# EasyEDA Pro project STM32F407VG.eprj

# Schematic Schematic1
Board Name: Board1; Create Date: 2025-10-14; Page Name: P1; Project Name: STM32F407VG; Schematic Name: Schematic1; Update Date: 2025-10-16; Company: 嘉立创EDA; Page Size: A4; Version: V1.0
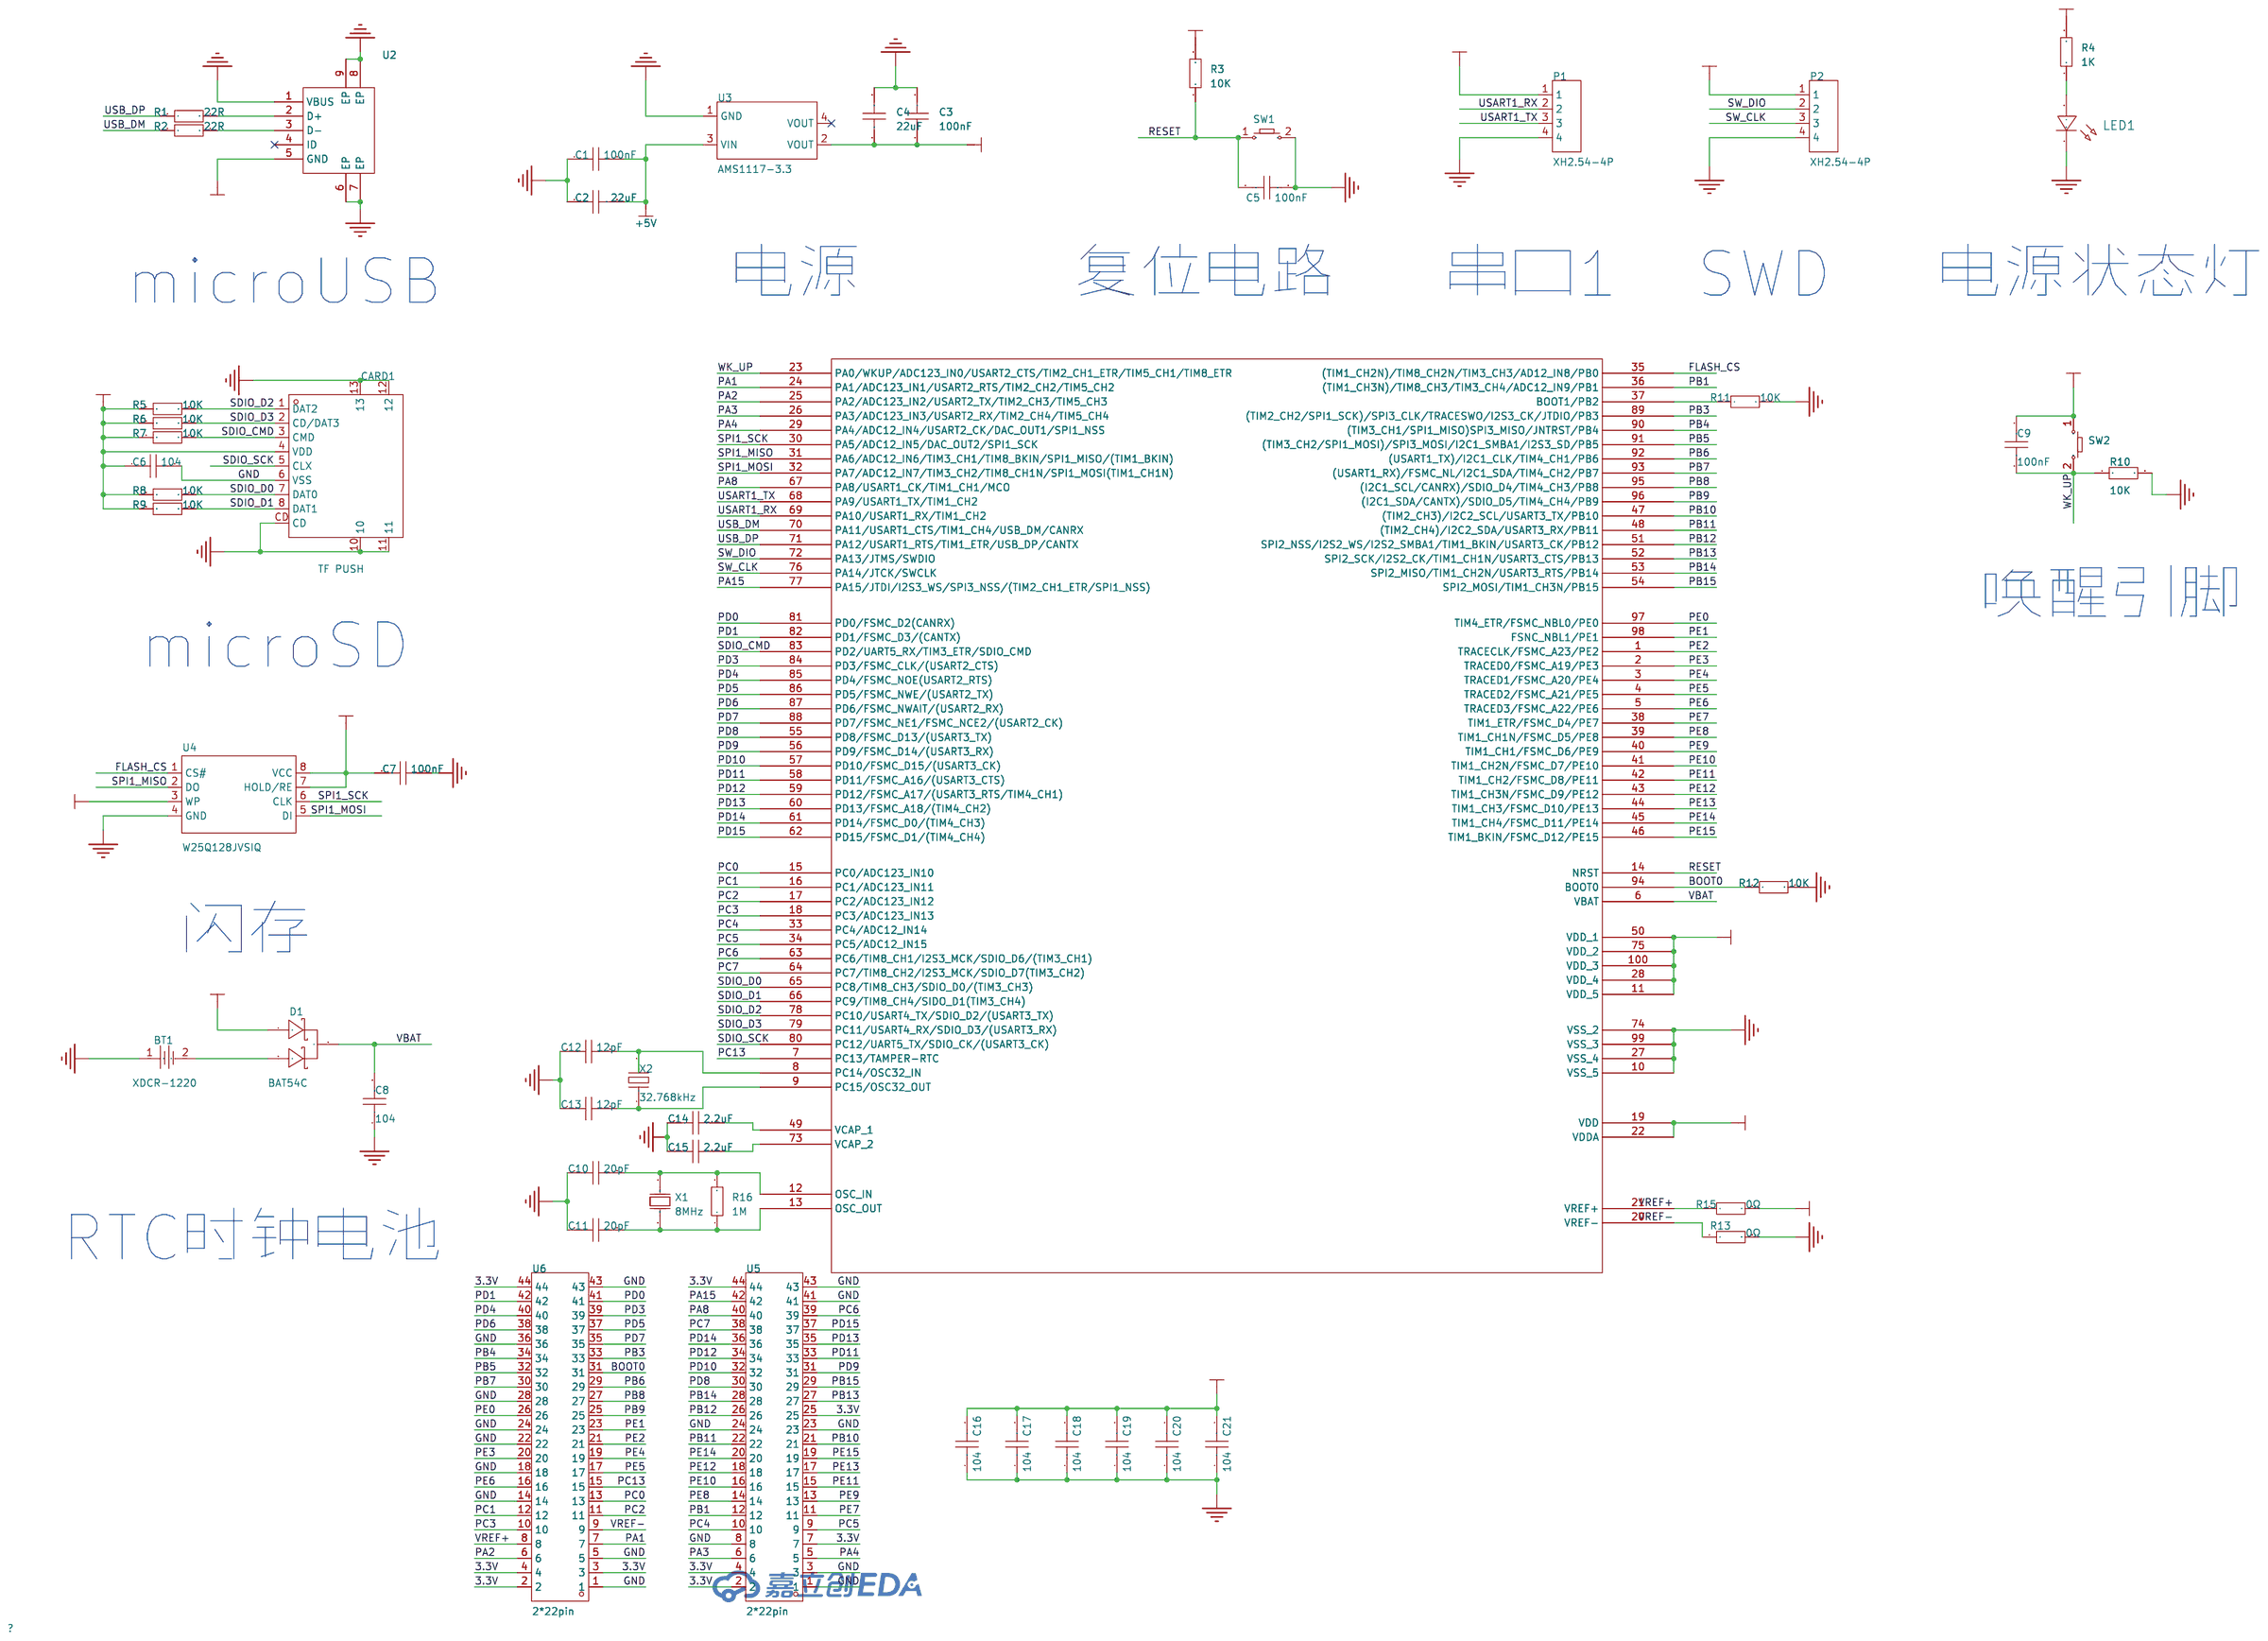
[diagram p0: schematic sheet]

## Parts
BT1  XDCR-1220  [BAT-SMD_CR1220-2ZX]
C1  100nF  [C0603]
C2  22uF  [C0603]
C3  100nF  [C0603]
C4  22uF  [C0603]
C5  100nF  [C0603]
C6  104  [C0603]
C7  100nF  [C0603]
C8  104  [C0603]
C9  100nF  [C0603]
C10  20pF  [C0603]
C11  20pF  [C0603]
C12  12pF  [C0603]
C13  12pF  [C0603]
C14  2.2uF  [C0603]
C15  2.2uF  [C0603]
C16  104  [C0603]
C17  104  [C0603]
C18  104  [C0603]
C19  104  [C0603]
C20  104  [C0603]
C21  104  [C0603]
CARD1  TF PUSH  [TF-SMD_TF-PUSH]
D1  BAT54C  [SOT-23-3_L2.9-W1.6-P1.90-LS2.8-BR]
LED1  -  [LED_0603]
P1  XH2.54-4P  [CONN-TH_4P-P2.50-XH2.54-4P]
P2  XH2.54-4P  [CONN-TH_4P-P2.50-XH2.54-4P]
R1  22R  [R0603]
R2  22R  [R0603]
R3  10K  [R0603]
R4  1K  [R0603]
R5  10K  [R0603]
R6  10K  [R0603]
R7  10K  [R0603]
R8  10K  [R0603]
R9  10K  [R0603]
R10  10K  [R0603]
R11  10K  [R-BIG-0603]
R12  10K  [R-BIG-0603]
R13  0Ω  [R-BIG-0603]
R15  0Ω  [R-BIG-0603]
R16  1M  [R0603]
SW1  -  [Key_SMD_3x4x2]
SW2  -  [Key_SMD_3x4x2]
U1  STM32F407VGT6  [STM32F407VG]
U2  USB-Micro-5P  [MICRO-USB-SMD_MICRO-USB-A9]
U3  AMS1117-3.3  [SOT-223-3_L6.5-W3.4-P2.30-LS7.0-BR]
U4  W25Q128JVSIQ  [SOIC-8_L5.3-W5.3-P1.27-LS8.0-BL]
U5  2*22pin  [HDR-TH_44P-2.54-V-F-R2-C22-S2.54]
U6  2*22pin  [HDR-TH_44P-2.54-V-F-R2-C22-S2.54]
X1  8MHz  [OSC-TH_L10.0-W4.5-P5.00]
X2  32.768kHz  [OSC-SMD_L3.2-W1.5]

## Library data of the parts
BT1 = XDCR-1220-006: LCSC Part Name: 电池底座 适用电池:CR1220; Supplier Part: C7498147; Manufacturer: LX(连欣科技); Supplier Footprint: SMD; JLCPCB Part Class: 扩展库; Datasheet: https://item.szlcsc.com/datasheet/XDCR-1220-006/8568589.html; Supplier: LCSC; Connector Type: 电池底座; Battery Type: CR1220; Contact Plating: 金; Operating Temperature: -40℃~+85℃
C1-C21 = CAP_0603: Supplier Footprint: 0603
CARD1 = TF PUSH: LCSC Part Name: 自弹式 MicroSD卡(TF卡) 卡座; Supplier Part: C393941; Manufacturer: SHOU HAN(首韩); Supplier Footprint: SMD; JLCPCB Part Class: 扩展库; Datasheet: https://item.szlcsc.com/datasheet/TF%2520PUSH/372553.html; Supplier: LCSC; Card Connection Mode: 自弹式; Card Type: MicroSD卡(TF卡); Connector Type: 卡座; Additional Card Detection Pins: 无; Height Above Board: 2mm; Operating Temperature: -25℃~+90℃
D1 = BAT54C,215: LCSC Part Name: 电压:30V 电流:200mA; Supplier Part: C37704; Manufacturer: Nexperia(安世); Supplier Footprint: SOT-23; JLCPCB Part Class: 扩展库; Datasheet: https://item.szlcsc.com/datasheet/BAT54C%252C215/38684.html; Supplier: LCSC; Diode Configuration: 1对共阴极; Voltage - Forward(Vf@If): 800mV@100mA; Voltage - DC Reverse(Vr): 30V; Current - Rectified: 200mA; Reverse Leakage Current (Ir): 2uA@25V; Non-Repetitive Peak Forward Surge Current: 600mA
LED1 = LED_0603-R: Supplier Footprint: 0603
P1 P2 = XH2.54-4P_C9900003326: Supplier Part: C9900003326; JLCPCB Part Class: 扩展库; Supplier: LCSC
R1-R13 R15 R16 = Res_0603: Supplier Footprint: 0603
SW1 SW2 = Key_SMD_3x4x2: Supplier Footprint: SMD
U1 = STM32F407VGT6
U2 = USB-Micro-5P: Supplier Part: C9900014288; JLCPCB Part Class: 扩展库; Supplier: LCSC
U3 = AMS1117-3.3_C6186: 输出类型:固定;工作电压:16V;输出电压:3.3V;输出电流:1A;电源纹波抑制比(PSRR):72dB@(120Hz);输出极性:正极;; LCSC Part Name: 输出3.3V 1A; Supplier Part: C6186; Manufacturer: AMS; Supplier Footprint: SOT-223; JLCPCB Part Class: 基础库; Datasheet: https://item.szlcsc.com/datasheet/AMS1117-3.3/6652.html; Supplier: LCSC; Output Type: 固定; Voltage - Supply: 16V; Output Voltage: 3.3V; Output Current: 1A; Power Supply Rejection Ratio (PSRR): 72dB@(120Hz); Voltage Dropout: 1.1V@(800mA); standby current: 5mA; Features: 过流保护；过热保护; Operating Temperature: -40℃~+125℃; Output Configuration: 正极; Number of Outputs: 1
U4 = W25Q128JVSIQ: 接口类型:SPI;存储容量:128Mbit;时钟频率(fc):133MHz;; LCSC Part Name: 编带 支持双路/四路SPI接口的3V、128Mbit 串行闪存; Supplier Part: C97521; Manufacturer: Winbond(华邦); Supplier Footprint: SOIC-8-208mil; JLCPCB Part Class: 基础库; Datasheet: https://item.szlcsc.com/datasheet/W25Q128JVSIQ/98729.html; Supplier: LCSC; Interface: SPI; Memory Size: 128Mbit; Clock Frequency: 133MHz; Voltage - Supply: 2.7V~3.6V; Standby Supply Current: 1uA; Program / Erase Cycles: 100000次; Page Programming Time (Tpp): 3ms; Block Erase Time(tBE): 120ms@(32KB); Data Retention - TDR (Year): 20年; Operating Temperature: -40℃~+85℃
U5 U6 = CS-1166SDIG-2X22(H8.5): LCSC Part Name: 2x22P 间距:2.54mm 直插; Supplier Part: C2986996; Manufacturer: CST(永丰盈); Supplier Footprint: 插件,P=2.54mm; JLCPCB Part Class: 扩展库; Datasheet: https://item.szlcsc.com/datasheet/CS-1166SDIG-2X22(H8.5)/3437779.html; Supplier: LCSC; Holes Structure: 2x22P; Pitch: 2.54mm; Row Spacing: 2.54mm; Mounting Type: 直插; Number of Rows: 双排; Number of Positions: 44P; Holes Direction: 顶部; Insulation Height: 8.5mm
X1 = X49SD8MSD2SC: LCSC Part Name: HC-49US 8MHZ 2P 49S 20PF ±20PPM -20~70℃ (±30PPM); Supplier Part: C21263; Manufacturer: YXC(扬兴晶振); Supplier Footprint: HC-49S; JLCPCB Part Class: 扩展库; Datasheet: https://item.szlcsc.com/datasheet/X49SD8MSD2SC/21980.html; Supplier: LCSC; Type: 直插晶振; Normal temperature Frequency Tolerance: ±20ppm; Load Capacitance: 20pF; Frequency Stability: ±30ppm; Operating Temperature: -20℃~+70℃
X2 = X321532768KGD2SI: LCSC Part Name: YST310S 32.768KHZ 2P 3215 12.5PF ±20PPM -40~85℃; Supplier Part: C620155; Manufacturer: YXC(扬兴晶振); Supplier Footprint: SMD3215-2P; JLCPCB Part Class: 扩展库; Datasheet: https://item.szlcsc.com/datasheet/X321532768KGD2SI/649983.html; Supplier: LCSC; Type: 贴片晶振; Normal temperature Frequency Tolerance: ±20ppm; Load Capacitance: 12.5pF; Frequency Stability: ±30ppm; Operating Temperature: -40℃~+85℃

## Nets
3.3V: C3.2 C4.2 C6.1 C7.1 C9.2 C16.2 C17.2 C18.2 C19.2 C20.2 C21.2 CARD1.4(VDD) D1.1(A) P1.1 P2.1 R3.1 R4.2 R5.1 R6.1 R7.1 R8.1 R9.1 R15.2 SW2.1 U1.11(VDD_5) U1.19(VDD) U1.22(VDDA) U1.28(VDD_4) U1.50(VDD_1) U1.75(VDD_2) U1.100(VDD_3) U3.2(VOUT) U4.3(WP) U4.7(HOLD/RE) U4.8(VCC) U5.2 U5.4 U5.7 U5.25 U5.44 U6.2 U6.3 U6.4 U6.44
+5V: C1.2 C2.2 U2.5(GND) U3.3(VIN)
GND: BT1.1 C1.1 C2.1 C3.1 C4.1 C5.2 C6.2 C7.2 C8.1 C10.1 C11.1 C12.1 C13.1 C14.1 C15.1 C16.1 C17.1 C18.1 C19.1 C20.1 C21.1 CARD1.6(VSS) CARD1.10 CARD1.11 CARD1.12 CARD1.13 CARD1.CD LED1.1(C) P1.4 P2.4 R10.2 R11.2 R12.2 R13.2 SW1.2 U1.10(VSS_5) U1.27(VSS_4) U1.74(VSS_2) U1.99(VSS_3) U2.1(VBUS) U2.6(EP) U2.7(EP) U2.8(EP) U2.9(EP) U3.1(GND) U4.4(GND) U5.1 U5.3 U5.8 U5.23 U5.24 U5.41 U5.43 U6.1 U6.5 U6.14 U6.18 U6.22 U6.24 U6.28 U6.36 U6.43
VBAT: C8.2 D1.3(K) U1.6(VBAT)
BOOT0: R12.1 U1.94(BOOT0) U6.31
FLASH_CS: U1.35((TIM1_CH2N)/TIM8_CH2N/TIM3_CH3/AD12_IN8/PB0) U4.1(CS#)
PA1: U1.24(PA1/ADC123_IN1/USART2_RTS/TIM2_CH2/TIM5_CH2) U6.7
PA2: U1.25(PA2/ADC123_IN2/USART2_TX/TIM2_CH3/TIM5_CH3) U6.6
PA3: U1.26(PA3/ADC123_IN3/USART2_RX/TIM2_CH4/TIM5_CH4) U5.6
PA4: U1.29(PA4/ADC12_IN4/USART2_CK/DAC_OUT1/SPI1_NSS) U5.5
PA8: U1.67(PA8/USART1_CK/TIM1_CH1/MCO) U5.40
PA15: U1.77(PA15/JTDI/I2S3_WS/SPI3_NSS/(TIM2_CH1_ETR/SPI1_NSS)) U5.42
PB1: U1.36((TIM1_CH3N)/TIM8_CH3/TIM3_CH4/ADC12_IN9/PB1) U5.12
PB3: U1.89((TIM2_CH2/SPI1_SCK)/SPI3_CLK/TRACESWO/I2S3_CK/JTDIO/PB3) U6.33
PB4: U1.90((TIM3_CH1/SPI1_MISO)SPI3_MISO/JNTRST/PB4) U6.34
PB5: U1.91((TIM3_CH2/SPI1_MOSI)/SPI3_MOSI/I2C1_SMBA1/I2S3_SD/PB5) U6.32
PB6: U1.92((USART1_TX)/I2C1_CLK/TIM4_CH1/PB6) U6.29
PB7: U1.93((USART1_RX)/FSMC_NL/I2C1_SDA/TIM4_CH2/PB7) U6.30
PB8: U1.95((I2C1_SCL/CANRX)/SDIO_D4/TIM4_CH3/PB8) U6.27
PB9: U1.96((I2C1_SDA/CANTX)/SDIO_D5/TIM4_CH4/PB9) U6.25
PB10: U1.47((TIM2_CH3)/I2C2_SCL/USART3_TX/PB10) U5.21
PB11: U1.48((TIM2_CH4)/I2C2_SDA/USART3_RX/PB11) U5.22
PB12: U1.51(SPI2_NSS/I2S2_WS/I2S2_SMBA1/TIM1_BKIN/USART3_CK/PB12) U5.26
PB13: U1.52(SPI2_SCK/I2S2_CK/TIM1_CH1N/USART3_CTS/PB13) U5.27
PB14: U1.53(SPI2_MISO/TIM1_CH2N/USART3_RTS/PB14) U5.28
PB15: U1.54(SPI2_MOSI/TIM1_CH3N/PB15) U5.29
PC0: U1.15(PC0/ADC123_IN10) U6.13
PC1: U1.16(PC1/ADC123_IN11) U6.12
PC2: U1.17(PC2/ADC123_IN12) U6.11
PC3: U1.18(PC3/ADC123_IN13) U6.10
PC4: U1.33(PC4/ADC12_IN14) U5.10
PC5: U1.34(PC5/ADC12_IN15) U5.9
PC6: U1.63(PC6/TIM8_CH1/I2S3_MCK/SDIO_D6/(TIM3_CH1)) U5.39
PC7: U1.64(PC7/TIM8_CH2/I2S3_MCK/SDIO_D7(TIM3_CH2)) U5.38
PC13: U1.7(PC13/TAMPER-RTC) U6.15
PD0: U1.81(PD0/FSMC_D2(CANRX)) U6.41
PD1: U1.82(PD1/FSMC_D3/(CANTX)) U6.42
PD3: U1.84(PD3/FSMC_CLK/(USART2_CTS)) U6.39
PD4: U1.85(PD4/FSMC_NOE(USART2_RTS)) U6.40
PD5: U1.86(PD5/FSMC_NWE/(USART2_TX)) U6.37
PD6: U1.87(PD6/FSMC_NWAIT/(USART2_RX)) U6.38
PD7: U1.88(PD7/FSMC_NE1/FSMC_NCE2/(USART2_CK)) U6.35
PD8: U1.55(PD8/FSMC_D13/(USART3_TX)) U5.30
PD9: U1.56(PD9/FSMC_D14/(USART3_RX)) U5.31
PD10: U1.57(PD10/FSMC_D15/(USART3_CK)) U5.32
PD11: U1.58(PD11/FSMC_A16/(USART3_CTS)) U5.33
PD12: U1.59(PD12/FSMC_A17/(USART3_RTS/TIM4_CH1)) U5.34
PD13: U1.60(PD13/FSMC_A18/(TIM4_CH2)) U5.35
PD14: U1.61(PD14/FSMC_D0/(TIM4_CH3)) U5.36
PD15: U1.62(PD15/FSMC_D1/(TIM4_CH4)) U5.37
PE0: U1.97(TIM4_ETR/FSMC_NBL0/PE0) U6.26
PE1: U1.98(FSNC_NBL1/PE1) U6.23
PE2: U1.1(TRACECLK/FSMC_A23/PE2) U6.21
PE3: U1.2(TRACED0/FSMC_A19/PE3) U6.20
PE4: U1.3(TRACED1/FSMC_A20/PE4) U6.19
PE5: U1.4(TRACED2/FSMC_A21/PE5) U6.17
PE6: U1.5(TRACED3/FSMC_A22/PE6) U6.16
PE7: U1.38(TIM1_ETR/FSMC_D4/PE7) U5.11
PE8: U1.39(TIM1_CH1N/FSMC_D5/PE8) U5.14
PE9: U1.40(TIM1_CH1/FSMC_D6/PE9) U5.13
PE10: U1.41(TIM1_CH2N/FSMC_D7/PE10) U5.16
PE11: U1.42(TIM1_CH2/FSMC_D8/PE11) U5.15
PE12: U1.43(TIM1_CH3N/FSMC_D9/PE12) U5.18
PE13: U1.44(TIM1_CH3/FSMC_D10/PE13) U5.17
PE14: U1.45(TIM1_CH4/FSMC_D11/PE14) U5.20
PE15: U1.46(TIM1_BKIN/FSMC_D12/PE15) U5.19
RESET: C5.1 R3.2 SW1.1 U1.14(NRST)
SDIO_CMD: CARD1.3(CMD) R7.2 U1.83(PD2/UART5_RX/TIM3_ETR/SDIO_CMD)
SDIO_D0: CARD1.7(DAT0) R8.2 U1.65(PC8/TIM8_CH3/SDIO_D0/(TIM3_CH3))
SDIO_D1: CARD1.8(DAT1) R9.2 U1.66(PC9/TIM8_CH4/SIDO_D1(TIM3_CH4))
SDIO_D2: CARD1.1(DAT2) R5.2 U1.78(PC10/USART4_TX/SDIO_D2/(USART3_TX))
SDIO_D3: CARD1.2(CD/DAT3) R6.2 U1.79(PC11/USART4_RX/SDIO_D3/(USART3_RX))
SDIO_SCK: CARD1.5(CLX) U1.80(PC12/UART5_TX/SDIO_CK/(USART3_CK))
SPI1_MISO: U1.31(PA6/ADC12_IN6/TIM3_CH1/TIM8_BKIN/SPI1_MISO/(TIM1_BKIN)) U4.2(DO)
SPI1_MOSI: U1.32(PA7/ADC12_IN7/TIM3_CH2/TIM8_CH1N/SPI1_MOSI(TIM1_CH1N)) U4.5(DI)
SPI1_SCK: U1.30(PA5/ADC12_IN5/DAC_OUT2/SPI1_SCK) U4.6(CLK)
SW_CLK: P2.3 U1.76(PA14/JTCK/SWCLK)
SW_DIO: P2.2 U1.72(PA13/JTMS/SWDIO)
USART1_RX: P1.2 U1.69(PA10/USART1_RX/TIM1_CH2)
USART1_TX: P1.3 U1.68(PA9/USART1_TX/TIM1_CH2)
USB_DM: R2.1 U1.70(PA11/USART1_CTS/TIM1_CH4/USB_DM/CANRX)
USB_DP: R1.1 U1.71(PA12/USART1_RTS/TIM1_ETR/USB_DP/CANTX)
VREF+: R15.1 U1.21(VREF+) U6.8
VREF-: R13.1 U1.20(VREF-) U6.9
WK_UP: C9.1 R10.1 SW2.2 U1.23(PA0/WKUP/ADC123_IN0/USART2_CTS/TIM2_CH1_ETR/TIM5_CH1/TIM8_ETR)
$1N889: R1.2 U2.2(D+)
$1N893: R2.2 U2.3(D-)
$1N2632: LED1.2(A) R4.1
$1N4325: BT1.2 D1.2(A)
$1N5861: R11.1 U1.37(BOOT1/PB2)
$1N7095: C11.2 R16.1 U1.13(OSC_OUT) X1.2(OSC2)
$1N7100: C10.2 R16.2 U1.12(OSC_IN) X1.1(OSC1)
$1N7274: C12.2 U1.8(PC14/OSC32_IN) X2.2
$1N7293: C13.2 U1.9(PC15/OSC32_OUT) X2.1
$1N7439: C15.2 U1.73(VCAP_2)
$1N7444: C14.2 U1.49(VCAP_1)

Not connected (* = marked no-connect by the designer): U2 4(ID)*; U3 4(VOUT)*

## Notes on the sheet
- 电源
- 复位电路
- 串口1
- SWD
- 电源状态灯
- microUSB
- 唤醒引脚
- microSD
- 闪存
- RTC时钟电池

# Board PCB1
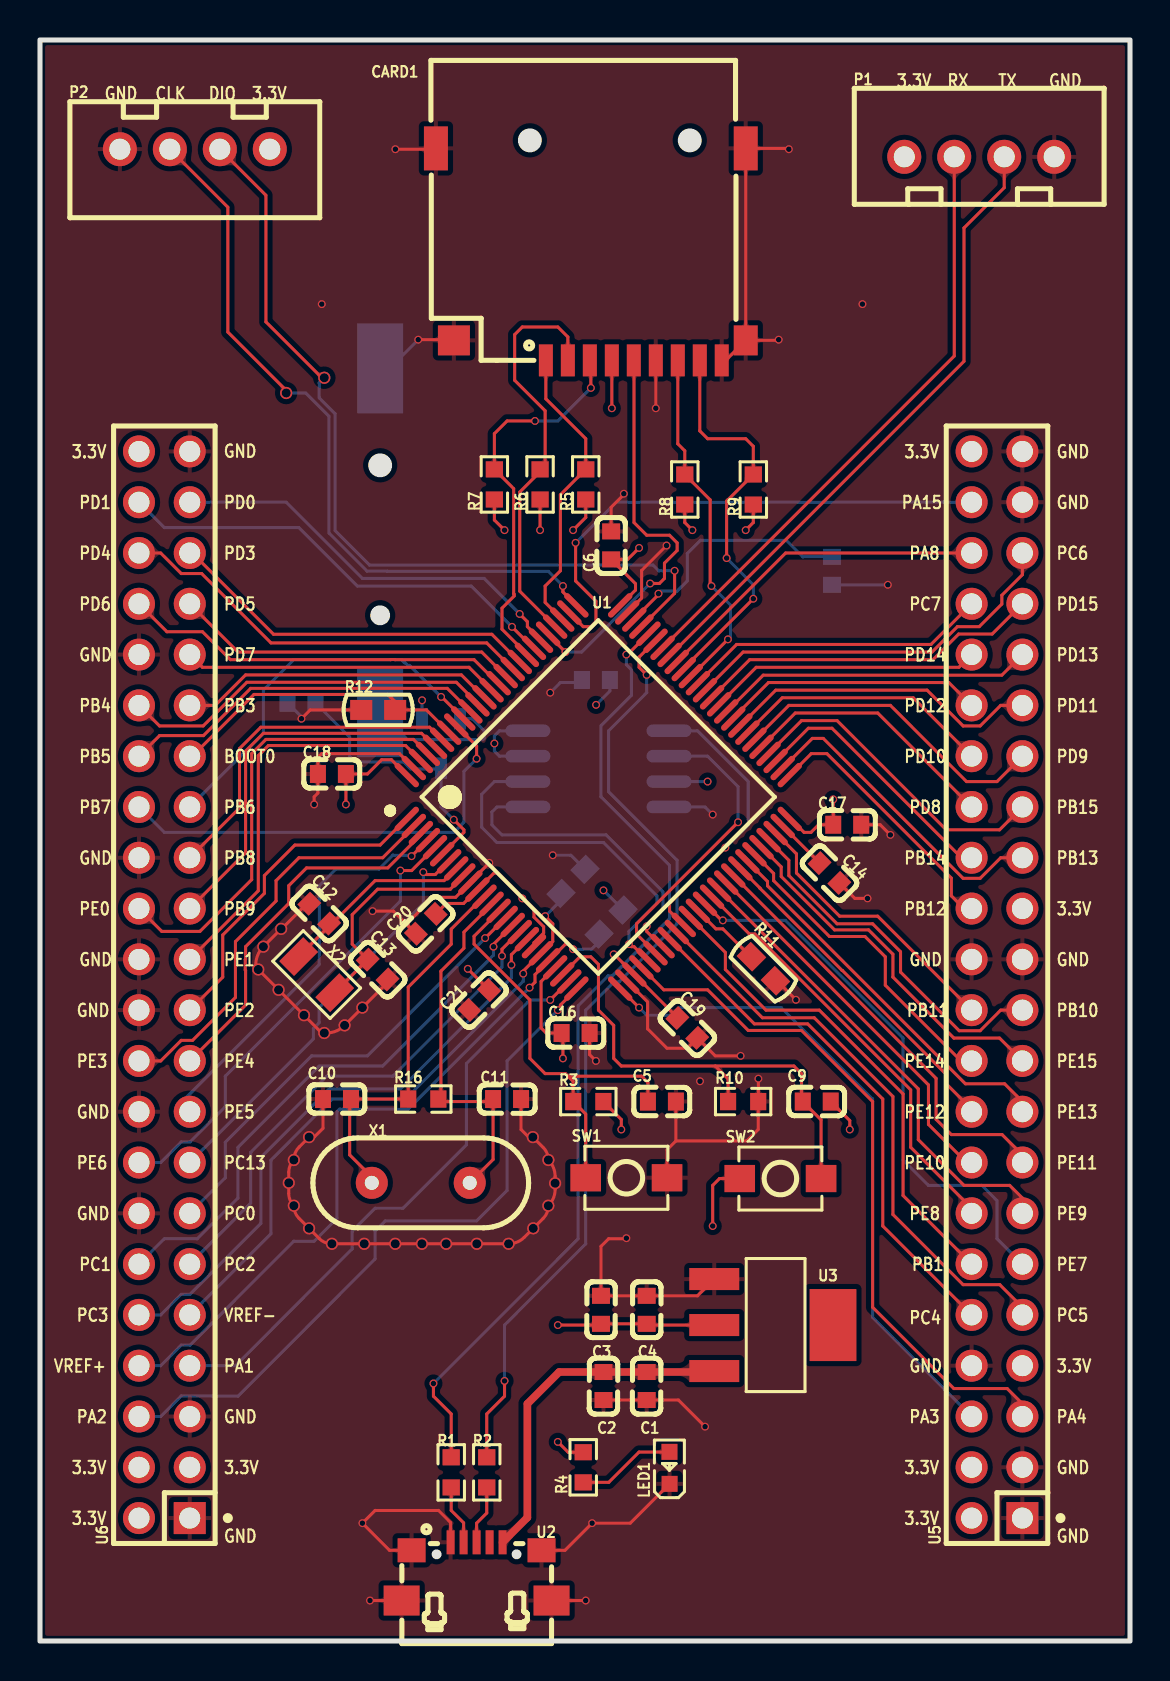
[diagram p1: board, top side]
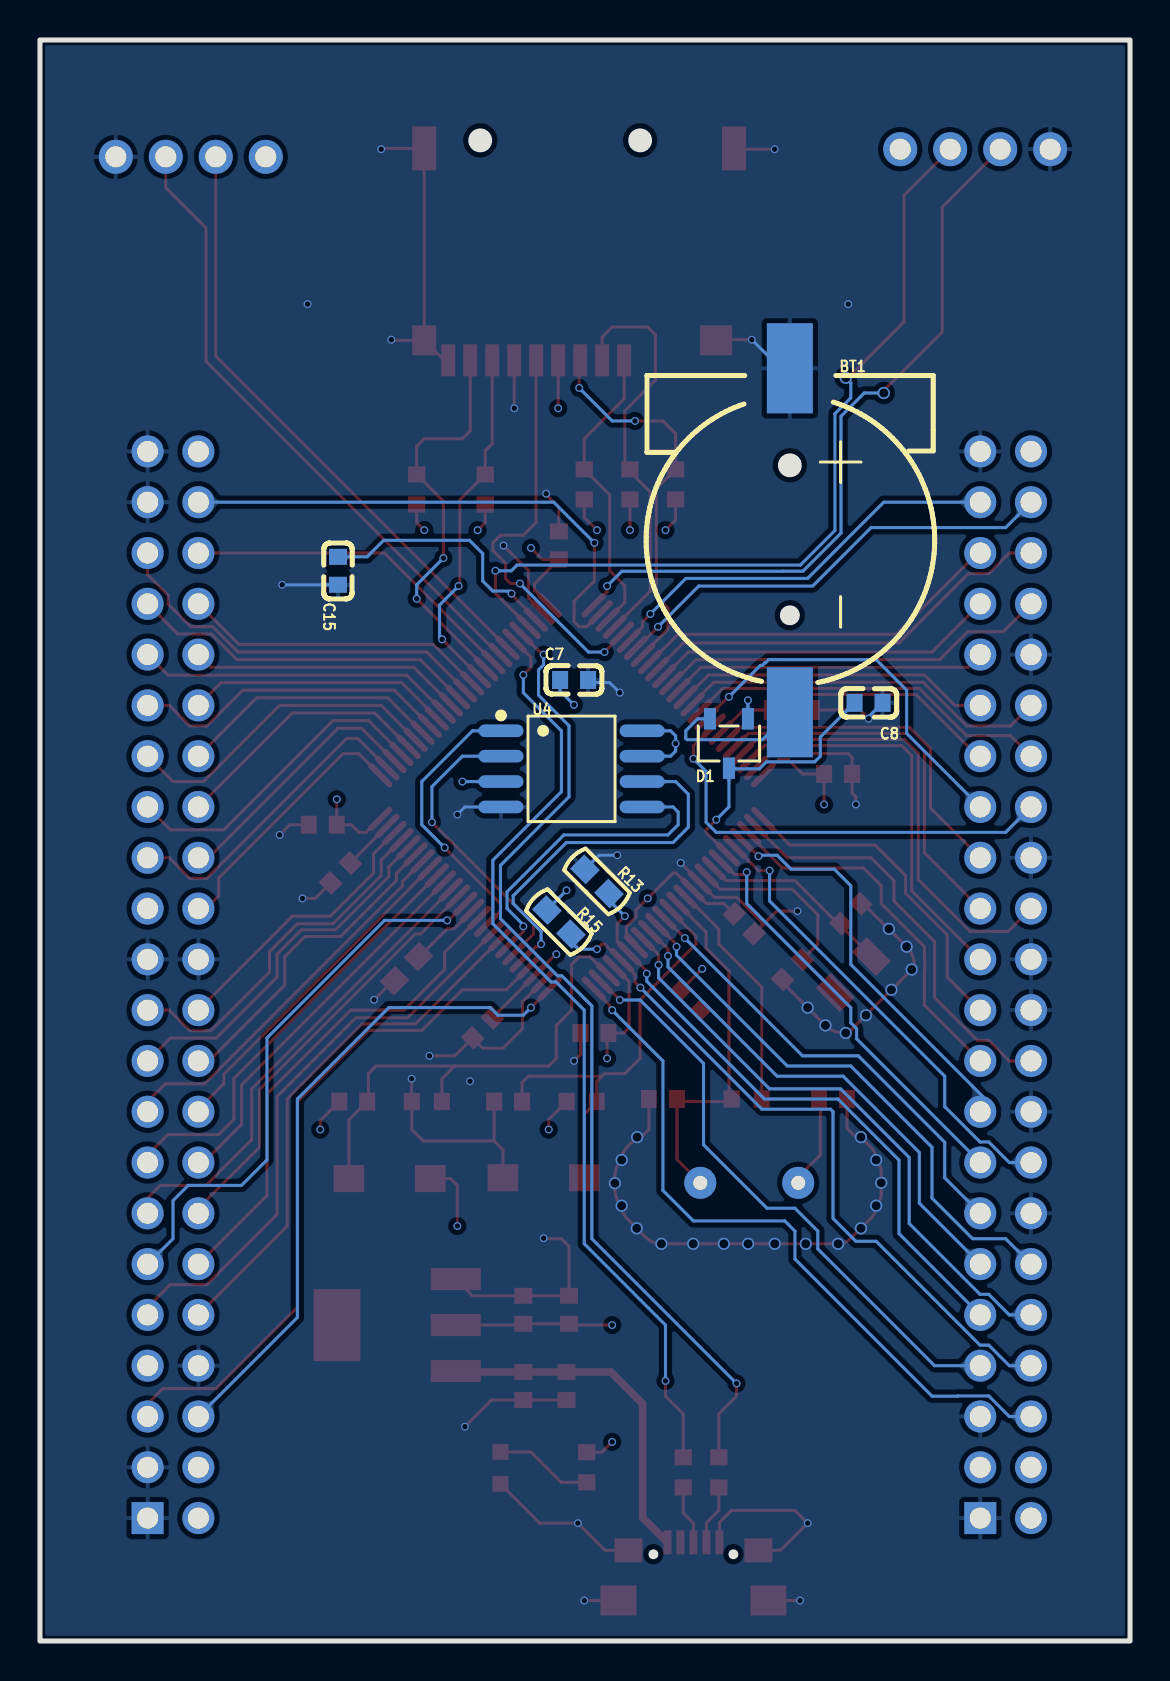
[diagram p2: board, bottom side, seen from below]

Outline 54.53 x 80.06 mm; copper layers: Top Layer, GND, 3.3V, Bottom Layer. Coordinates in mm from the lower left corner of the outline.
Outline path: rectangle 0,80.06 54.53,0
Stack: Top Layer 0.035mm 外层铜厚1oz / Dielectric1 0.2104mm 7628 RC49% 8.6mil / GND 0.0152mm 内层铜厚 / Dielectric2 1.065mm 1.1mm H/HOZ Copper / 3.3V 0.0152mm 内层铜厚 / Dielectric3 0.2104mm 7628 RC49% 8.6mil / Bottom Layer 0.035mm 外层铜厚1oz

## Design rules (mm)
template: 自定义配置
spacing copperThickness1oz (default): track to track 0.152, other pairs 0.152 to 0.3
spacing copperThickness2oz: track to track 0.203, other pairs 0.152 to 0.3
track width copperThickness1oz (default): min 0.152, default 0.152, max 1.27
track width copperThickness2oz: min 0.203, default 0.254, max 2.54
differential pair differentialPair (default): width min 0.127, default 0.254, max 2.54; gap min 0.152, default 0.152
via viaSize (default): diameter min 0.35, default 0.394, max 10; hole min 0.279, default 0.356, max 6.3

## Placement (name value [footprint] x y rotation side)
BT1  XDCR-1220  [BAT-SMD_CR1220-2ZX]  17.02 55.04 270 bottom
C1  100nF  [C0603]  30.35 12.75 90 top
C2  22uF  [C0603]  28.19 12.75 90 top
C3  100nF  [C0603]  28.07 16.56 270 top
C4  22uF  [C0603]  30.35 16.56 270 top
C5  100nF  [C0603]  31.11 26.98 0 top
C6  104  [C0603]  28.58 54.79 90 top
C7  100nF  [C0603]  27.81 48.06 180 bottom
C8  104  [C0603]  13.08 46.91 0 bottom
C9  100nF  [C0603]  38.86 26.98 0 top
C10  20pF  [C0603]  14.86 27.1 0 top
C11  20pF  [C0603]  23.37 27.1 180 top
C12  12pF  [C0603]  13.97 36.37 315 top
C13  12pF  [C0603]  16.89 33.58 135 top
C14  2.2uF  [C0603]  39.5 38.41 135 top
C15  2.2uF  [C0603]  39.62 53.52 90 bottom
C16  104  [C0603]  26.8 30.4 180 top
C17  104  [C0603]  40.39 40.82 180 top
C18  104  [C0603]  14.61 43.36 0 top
C19  104  [C0603]  32.39 30.66 135 top
C20  104  [C0603]  19.3 35.87 45 top
C21  104  [C0603]  21.97 32.06 45 top
CARD1  TF PUSH  [TF-SMD_TF-PUSH]  27.56 69.34 180 top
D1  BAT54C  [SOT-23-3_L2.9-W1.6-P1.90-LS2.8-BR]  20.07 44.88 90 bottom
LED1  -  [LED_0603]  31.49 8.71 90 top
P1  XH2.54-4P  [CONN-TH_4P-P2.50-XH2.54-4P]  46.99 74.22 180 top
P2  XH2.54-4P  [CONN-TH_4P-P2.50-XH2.54-4P]  7.75 74.6 0 top
R1  22R  [R0603]  20.57 8.43 270 top
R2  22R  [R0603]  22.35 8.43 270 top
R3  10K  [R0603]  27.43 26.98 180 top
R4  1K  [R0603]  27.18 8.69 90 top
R5  10K  [R0603]  27.3 57.84 90 top
R6  10K  [R0603]  25.02 57.84 90 top
R7  10K  [R0603]  22.73 57.84 90 top
R8  10K  [R0603]  32.26 57.58 90 top
R9  10K  [R0603]  35.69 57.58 90 top
R10  10K  [R0603]  35.18 26.98 0 top
R11  10K  [R-BIG-0603]  36.32 33.71 315 top
R12  10K  [R-BIG-0603]  16.89 46.41 180 top
R13  0Ω  [R-BIG-0603]  26.8 37.9 45 bottom
R15  0Ω  [R-BIG-0603]  28.7 35.87 45 bottom
R16  1M  [R0603]  19.18 27.1 180 top
SW1  -  [Key_SMD_3x4x2]  29.34 23.17 0 top
SW2  -  [Key_SMD_3x4x2]  37.04 23.13 0 top
U1  STM32F407VGT6  [STM32F407VG]  27.94 42.22 315 top
U2  USB-Micro-5P  [MICRO-USB-SMD_MICRO-USB-A9]  21.84 3.48 0 top
U3  AMS1117-3.3  [SOT-223-3_L6.5-W3.4-P2.30-LS7.0-BR]  36.7 15.8 180 top
U4  W25Q128JVSIQ  [SOIC-8_L5.3-W5.3-P1.27-LS8.0-BL]  27.94 43.61 270 bottom
U5  2*22pin  [HDR-TH_44P-2.54-V-F-R2-C22-S2.54]  47.88 32.82 90 top
U6  2*22pin  [HDR-TH_44P-2.54-V-F-R2-C22-S2.54]  6.22 32.82 90 top
X1  8MHz  [OSC-TH_L10.0-W4.5-P5.00]  19.05 22.91 90 top
X2  32.768kHz  [OSC-SMD_L3.2-W1.5]  13.84 33.33 135 top

## Footprints (pads in the part's own frame, mm; a bottom-side part is the same pattern mirrored in y, then rotated)
BAT-SMD_CR1220-2ZX
  rect 4.5x2.3 smd: 1(-8.6,0) 2(8.6,0)
C0603
  rect 0.8x0.9 smd: 1(-0.7,0) 2(0.7,0)
CONN-TH_4P-P2.50-XH2.54-4P
  round 1.7 hole 1.05: 1(3.75,0) 2(1.25,0) 3(-1.25,0) 4(-3.75,0)
HDR-TH_44P-2.54-V-F-R2-C22-S2.54
  rect 1.6x1.6 hole 1.05: 1(-26.67,-1.27)
  round 1.6 hole 1.05: 2(-26.67,1.27) 3(-24.13,-1.27) 4(-24.13,1.27) 5(-21.59,-1.27) 6(-21.59,1.27) 7(-19.05,-1.27) 8(-19.05,1.27) 9(-16.51,-1.27) 10(-16.51,1.27) 11(-13.97,-1.27) 12(-13.97,1.27) 13(-11.43,-1.27) 14(-11.43,1.27) 15(-8.89,-1.27) 16(-8.89,1.27) 17(-6.35,-1.27) 18(-6.35,1.27) 19(-3.81,-1.27) 20(-3.81,1.27) 21(-1.27,-1.27) 22(-1.27,1.27) 23(1.27,-1.27) 24(1.27,1.27) 25(3.81,-1.27) 26(3.81,1.27) 27(6.35,-1.27) 28(6.35,1.27) 29(8.89,-1.27) 30(8.89,1.27) 31(11.43,-1.27) 32(11.43,1.27) 33(13.97,-1.27) 34(13.97,1.27) 35(16.51,-1.27) 36(16.51,1.27) 37(19.05,-1.27) 38(19.05,1.27) 39(21.59,-1.27) 40(21.59,1.27) 41(24.13,-1.27) 42(24.13,1.27) 43(26.67,-1.27) 44(26.67,1.27)
Key_SMD_3x4x2
  rect 1.53x1.36 smd: 1(-2.035,0) 2(2.035,0)
LED_0603
  rect 0.8x0.8 smd: 1(-0.851,-0.01) 2(0.75,-0.005)
MICRO-USB-SMD_MICRO-USB-A9
  rect 0.4x1.2 smd: 1(-1.3,1.455) 2(-0.65,1.455) 3(0,1.455) 4(0.65,1.455) 5(1.3,1.455)
  rect 1.4x1.2 smd: 6(3.25,1.055) 7(-3.25,1.055)
  rect 1.8x1.5 smd: 8(-3.75,-1.455) 9(3.75,-1.455)
OSC-SMD_L3.2-W1.5
  rect 1.05x1.7 smd: 1(-1.275,0) 2(1.275,0)
OSC-TH_L10.0-W4.5-P5.00
  round 1.6 hole 0.7: 1(0,2.45) 2(0,-2.45)
R0603
  rect 0.806x0.864 smd: 1(-0.753,0) 2(0.753,0)
R-BIG-0603
  rect 1.1x1 smd: 1(-0.879,-0.153) 2(0.821,-0.153)
SOIC-8_L5.3-W5.3-P1.27-LS8.0-BL
  oval 0.63x2.25 smd: 1(-1.905,-3.53) 2(-0.635,-3.53) 3(0.635,-3.53) 4(1.905,-3.53) 5(1.905,3.53) 6(0.635,3.53) 7(-0.635,3.53) 8(-1.905,3.53)
SOT-23-3_L2.9-W1.6-P1.90-LS2.8-BR
  rect 1.07x0.6 smd: 1(1.235,-0.95) 2(1.235,0.95) 3(-1.235,0)
SOT-223-3_L6.5-W3.4-P2.30-LS7.0-BR
  rect 2.5x1.1 smd: 1(2.97,-2.3) 2(2.97,0) 3(2.97,2.3)
  rect 2.34x3.6 smd: 4(-2.97,0)
STM32F407VG
  oval 0.3x1.6 smd: 1(-6,-7.563) 2(-5.5,-7.563) 3(-5,-7.563) 4(-4.5,-7.563) 5(-4,-7.563) 6(-3.5,-7.563) 7(-3,-7.563) 8(-2.5,-7.563) 9(-2,-7.563) 10(-1.5,-7.563) 11(-1,-7.563) 12(-0.5,-7.563) 13(0,-7.563) 14(0.5,-7.563) 15(1,-7.563) 16(1.5,-7.563) 17(2,-7.563) 18(2.5,-7.563) 19(3,-7.563) 20(3.5,-7.563) 21(4,-7.563) 22(4.5,-7.563) 23(5,-7.563) 24(5.5,-7.563) 25(6,-7.563) 51(6,7.537) 52(5.5,7.537) 53(5,7.537) 54(4.5,7.537) 55(4,7.537) 56(3.5,7.537) 57(3,7.537) 58(2.5,7.537) 59(2,7.537) 60(1.5,7.537) 61(1,7.537) 62(0.5,7.537) 63(0,7.537) 64(-0.5,7.537) 65(-1,7.537) 66(-1.5,7.537) 67(-2,7.537) 68(-2.5,7.537) 69(-3,7.537) 70(-3.5,7.537) 71(-4,7.537) 72(-4.5,7.537) 73(-5,7.537) 74(-5.5,7.537) 75(-6,7.537)
  oval 1.6x0.3 smd: 26(7.55,-6.013) 27(7.55,-5.513) 28(7.55,-5.013) 29(7.55,-4.513) 30(7.55,-4.013) 31(7.55,-3.513) 32(7.55,-3.013) 33(7.55,-2.513) 34(7.55,-2.013) 35(7.55,-1.513) 36(7.55,-1.013) 37(7.55,-0.513) 38(7.55,-0.013) 39(7.55,0.487) 40(7.55,0.987) 41(7.55,1.487) 42(7.55,1.987) 43(7.55,2.487) 44(7.55,2.987) 45(7.55,3.487) 46(7.55,3.987) 47(7.55,4.487) 48(7.55,4.987) 49(7.55,5.487) 50(7.55,5.987) 76(-7.55,5.987) 77(-7.55,5.487) 78(-7.55,4.987) 79(-7.55,4.487) 80(-7.55,3.987) 81(-7.55,3.487) 82(-7.55,2.987) 83(-7.55,2.487) 84(-7.55,1.987) 85(-7.55,1.487) 86(-7.55,0.987) 87(-7.55,0.487) 88(-7.55,-0.013) 89(-7.55,-0.513) 90(-7.55,-1.013) 91(-7.55,-1.513) 92(-7.55,-2.013) 93(-7.55,-2.513) 94(-7.55,-3.013) 95(-7.55,-3.513) 96(-7.55,-4.013) 97(-7.55,-4.513) 98(-7.55,-5.013) 99(-7.55,-5.513) 100(-7.55,-6.013)
TF-SMD_TF-PUSH
  rect 0.7x1.6 smd: 1(2.25,5.3) 2(1.15,5.3) 3(0.05,5.3) 4(-1.05,5.3) 5(-2.15,5.3) 6(-3.25,5.3) 7(-4.35,5.3) 8(-5.45,5.3) CD(-6.55,5.3)
  rect 1.2x1.5 smd: 10(-7.75,4.3)
  rect 1.2x2.2 smd: 11(-7.75,-5.3) 12(7.75,-5.3)
  rect 1.6x1.5 smd: 13(6.85,4.3)

## Nets
As in the schematic.

Pads without a net: U2 4; U3 4

## Via types
v1: diameter 0.61, hole 0.457, Top Layer to Bottom Layer, 27 vias
v2: diameter 0.394, hole 0.28, Top Layer to Bottom Layer, 93 vias

## Routing (per net, layer and track width the routed paths; a pad name or vN(x,y) marks a point on that pad's centre or on a via; arc(x,y) is an arc through that point)
3.3V: length 231.5
  Top Layer w0.152: R5.1 27.3,56.19 v2(26.67,55.55) ; R8.1 32.26,55.93 v2(32.64,55.55) ; U1.19 24.71,34.92 25.2,35.4 25.2,35.72 24.71,36.2 24.71,36.55 v2(24.13,37.14) 22.86,38.41 22.72,38.41 U1.11 21.19,36.88 20.32,36.88 C20.2 ; CARD1.4 v2(28.61,61.65) ; R7.1 22.73,56.06 v2(23.24,55.55) ; v2(15.3,41.83) C18.2 16.38,43.36 17.09,44.07 17.58,44.07 U1.100 ; v2(25.91,9.96) 26.42,9.44 R4.2 ; U3.2 30.42,15.8 C4.2 C3.2 28,15.8 v2(25.91,15.8) ; R9.1 35.69,55.93 v2(35.31,55.55) ; v2(33.65,20.75) 33.65,22.78 34,23.13 SW2.1 ; R6.1 v2(25.02,55.55) ; v2(29.97,54.66) 29.4,54.09 C6.1 29.79,52.87 29.79,52.55 U1.75 ; 39.56,40.95 39.43,40.82 38.95,40.82 38.57,40.44 38.23,40.44 37.55,41.11 U1.50 ; C19.2 31.89,31.18 U1.28 28.72,34.34 v2(28.7,34.34) ; v2(29.08,25.58) 29.08,26.08 R3.1 ; C17.2 v2(39.69,42.09) ; 25.77,33.69 25.07,32.98 25.07,30.66 25.32,30.4 C16.2 26.16,30.34 v2(26.16,29.13) ; v2(40.51,25.58) 40.51,26.02 C9.2 ; C21.2 v2(21.4,33.61)
  3.3V w0.152: v2(22.73,44.88) 21.72,44.88 19.56,47.04 v2(19.12,47.04) ; v2(22.73,44.88) 25.89,44.88 v2(27.82,46.81) ; v2(22.73,44.88) 22.73,43.74 20.45,41.45 15.69,41.45 v2(15.3,41.83) ; 4.95,6.15 U6.4 11.43,8.69 18.54,15.8 v2(25.91,15.8) 25.02,14.91 25.02,10.85 v2(25.91,9.96) ; v2(29.97,54.66) 29.97,57.33 28.61,58.69 v2(28.61,61.65) ; v2(26.67,55.55) v2(25.02,55.55) v2(23.24,55.55) ; P2.1 11.5,68.32 4.95,61.77 U6.44 ; v2(26.16,29.13) 29.08,26.21 v2(29.08,25.58) 29.08,22.53 30.86,20.75 v2(33.65,20.75) 39.24,20.75 40.51,22.02 v2(40.51,25.58) ; 46.61,6.15 U5.4 48.01,10.08 48.01,12.75 49.02,13.77 U5.7 ; v2(28.7,34.34) 28.7,37.03 v2(28.19,37.54) ; U5.44 43.24,62.86 P1.1 ; v2(24.13,37.14) 23.49,37.14 21.72,35.36 21.72,33.93 v2(21.4,33.61) ; U5.25 47.75,38.02 45.47,38.02 41.4,42.09 v2(39.69,42.09) 34.29,42.09 v2(33.4,42.98) ; v2(32.64,55.55) v2(35.31,55.55)
  Bottom Layer w0.152: U4.7 22.99,44.25 22.73,44.5 v2(22.73,44.88) 22.73,45.26 22.99,45.52 U4.8 ; v2(27.82,46.81) 28.51,47.51 C7.1 ; v2(28.19,37.54) 29.17,36.56 ; D1.1 v2(19.12,47.04) ; U4.3 v2(33.4,42.98)
+5V: length 17.5
  Top Layer w0.381: 33.73,13.5 33.68,13.45 25.97,13.45 24.38,11.86 24.38,6.18 U2.5
GND: length 534.4
  Top Layer w0.152: C13.1 17.39,32.93 v1(16.13,31.67) v1(15.24,30.79) arc(14.82,30.5) 14.32,30.4 v1(14.22,30.4) arc(14.11,30.43) 14.01,30.49 v1(13.21,31.29) v1(11.94,32.56) v1(10.92,33.58) 10.92,33.68 10.8,33.8 arc(10.89,34.3) v1(11.18,34.72) v1(12.06,35.61) 12.19,35.74 12.22,35.74 13.35,36.87 13.47,36.87 ; v2(13.08,46.12) 13.52,46.56 R12.2 ; U2.1 20.54,5.92 19.94,6.53 16.76,6.53 v2(16.13,5.89) 17.49,4.53 U2.7 ; v2(18.92,65.08) 20.67,65.08 CARD1.13 ; 31.81,25.01 35.36,25.01 35.93,25.58 R10.2 35.94,26.98 v2(35.94,28.12) ; 31.81,25.01 31.37,24.56 31.37,23.17 SW1.2 ; 31.81,25.01 C5.2 ; v2(33.27,10.72) 31.94,12.05 C1.1 C2.1 ; R11.2 36.87,33.02 v2(37.82,32.06) ; C14.1 40.77,37.14 v2(41.4,37.14) ; v2(22.48,38.91) 21.53,37.97 U1.10 20.79,37.19 19.67,37.19 18.42,35.94 18.42,35.76 ; v2(27.81,29.01) 27.5,29.32 27.5,30.4 ; C6.2 28.58,56.69 29.21,57.33 v2(29.21,57.37) ; v2(17.78,74.6) 19.77,74.6 CARD1.12 ; v2(16.64,36.5) 17.68,36.5 18.42,35.76 ; U3.1 32.89,17.26 C4.1 C3.1 28.07,19.74 28.45,20.12 29.31,20.12 v2(29.34,20.14) ; U1.74 30.1,52.15 30.1,53.53 v2(31.35,54.78) ; v2(37.46,74.6) 37.42,74.64 CARD1.11 CARD1.10 ; LED1.1 29.53,5.89 v2(27.62,5.89) 26.27,4.53 U2.6 ; 18.7,43.66 17.98,44.37 14.1,44.37 13.9,44.18 C18.1 13.9,42.4 13.72,42.22 v2(13.72,41.83) ; v2(35.05,29.26) 33.78,29.26 32.89,30.15 32.39,29.64 31.37,29.64 30.4,30.61 30.4,31.96 U1.27 ; v2(42.55,40.31) 42.04,40.82 C17.1 ; CARD1.10 36.92,65.04 v2(36.96,65.08) ; CARD1.10 34.31,64.04 CARD1.CD ; 18.42,35.76 C20.1 ; CARD1.6 v2(30.81,61.65) ; U2.8 v2(16.51,2.03) ; C10.1 14.16,25.64 13.72,25.2 v1(13.46,25.2) 12.97,24.7 arc(12.77,24.41) v1(12.7,24.05) arc(12.51,23.77) 12.45,23.44 v1(12.45,22.91) 12.45,22.38 arc(12.51,22.05) v1(12.7,21.77) arc(12.77,21.43) 12.96,21.14 v1(13.46,20.64) 13.97,20.12 arc(14.26,19.93) v1(14.61,19.86) v1(16.22,19.86) v1(17.77,19.86) v1(19.11,19.86) v1(20.32,19.86) v1(21.85,19.86) v1(23.44,19.86) arc(23.87,19.95) 24.23,20.19 v1(24.68,20.64) 25.17,21.13 arc(25.36,21.42) v1(25.43,21.77) arc(25.68,22.14) 25.77,22.58 v1(25.77,22.89) 25.77,23.24 arc(25.68,23.68) v1(25.43,24.05) arc(25.37,24.39) 25.17,24.68 v1(24.66,25.2) 24.45,25.2 24.07,25.58 C11.1 ; U2.9 v2(27.3,2.03)
  GND w0.152: 4.95,39.17 3.68,37.9 3.68,35.36 U6.24 U6.22 3.68,30.28 3.68,27.48 4.7,26.47 U6.18 ; v2(27.3,2.03) 27.62,2.34 v2(27.62,5.89) 29.21,7.48 29.21,9.83 30.1,10.72 v2(33.27,10.72) ; v2(17.78,74.6) 16.76,74.6 15.87,73.71 15.87,68.63 v2(14.1,66.85) ; U5.43 U5.41 ; U5.43 50.74,61.08 P1.4 ; U5.43 48.51,59.49 v2(41.15,66.85) ; U5.41 50.42,55.68 50.42,35.36 U5.23 ; U5.41 47.88,55.68 45.34,55.68 42.48,52.82 v2(42.42,52.82) ; v2(14.1,66.85) 9.11,66.85 7.49,65.24 7.49,59.49 4,62.98 P2.4 ; v2(14.1,66.85) 15.87,65.08 v2(18.92,65.08) ; U5.23 48.01,32.94 46.25,32.94 45.34,32.03 45.34,15.04 U5.8 48.01,12.37 48.01,9.96 49.15,8.81 U5.3 48.01,7.54 45.97,7.54 42.8,10.72 v2(33.27,10.72) ; U5.23 U5.24 44.45,34.09 v2(41.4,37.14) ; v2(41.15,66.85) 39.37,65.08 v2(36.96,65.08) 36.96,63.55 35.05,61.65 v2(30.81,61.65) ; v2(41.15,66.85) 39.37,68.63 39.37,73.71 38.48,74.6 v2(37.46,74.6) ; v2(33.27,10.72) 33.27,10.34 33.4,10.21 42.67,10.21 45.71,7.18 48.12,7.18 49.15,6.15 ; v2(31.35,54.78) 31.35,55.24 v2(29.21,57.37) ; v1(14.61,19.86) 14.61,18.34 6.35,10.08 6.35,7.29 7.75,5.89 v2(16.13,5.89) 16.13,2.41 v2(16.51,2.03) ; v2(41.4,37.14) 42.55,38.28 v2(42.55,40.31) ; v2(41.4,37.14) 41.4,35.65 v2(37.82,32.06) 35.05,29.3 v2(35.05,29.26) ; v1(23.44,19.86) 27.94,19.86 28.19,20.12 29.31,20.12 v2(29.34,20.14) 31.78,20.14 33.02,21.39 v2(33.02,27.99) ; v2(35.05,29.26) 33.78,27.99 v2(33.02,27.99) ; v2(35.05,29.26) 35.94,28.37 v2(35.94,28.12) ; v2(22.48,38.91) 22.86,39.29 v2(25.65,39.29) 31.62,39.29 v2(33.65,41.33) 31.5,43.49 26.03,43.49 25.53,43.99 v2(25.53,47.42) ; v1(12.06,35.61) 12.06,37.26 13.72,38.91 v2(13.72,41.83) 12.7,42.85 12.7,45.74 v2(13.08,46.12) 9.92,46.12 7.75,48.3 7.07,48.3 6.04,49.33 U6.36 ; v1(13.21,31.29) 9.41,27.5 7.07,27.5 6.04,26.47 U6.18 ; v1(16.13,31.67) 16.64,32.18 v2(16.64,36.5) ; v2(33.02,27.99) 32,29.01 v2(27.81,29.01) ; U6.18 3.68,25.2 3.68,22.66 4.95,21.39
  Bottom Layer w0.152: C15.1 v2(42.42,52.82) ; v2(25.65,39.29) 26.56,39.29 R13.2 ; C8.1 13.08,46.21 v2(13.08,46.12) ; BT1.1 17.49,63.64 v2(18.92,65.08) ; U4.4 33.27,41.71 v2(33.65,41.33) ; v2(25.53,47.42) 26.03,47.93 26.99,47.93 C7.2
VBAT: length 13.5
  Top Layer w0.152: U1.6 20.12,39.35 21.21,40.44 21.21,40.56 v2(20.7,41.07)
  Bottom Layer w0.152: C8.2 15.49,45.2 15.49,44.24 15.77,43.96 18.19,43.96 18.54,43.61 20.03,43.61 D1.3 20.07,41.71 v2(20.7,41.07)
BOOT0: length 15.3
  Top Layer w0.152: U1.94 19.33,46.56 R12.1 17.77,46.96 17.4,47.33 10.71,47.33 7.62,44.25 7.49,44.25
FLASH_CS: length 14.1
  Top Layer w0.152: U1.35 32.19,35.81 31.5,36.5 31.5,36.88 v2(34.29,39.68)
  Bottom Layer w0.152: v2(34.29,39.68) 35.43,40.82 35.43,42.98 32.89,45.52 U4.1
PA1: length 29.8
  Top Layer w0.152: v2(25.53,32.06) 26.45,32.98 U1.24
  Bottom Layer w0.152: v2(25.53,32.06) 24.51,32.06 21.34,28.88 21.34,24.82 18.16,21.64 16.76,21.64 15.62,20.5 15.62,19.61 9.78,13.77 7.49,13.77
PA2: length 35.5
  Top Layer w0.152: U1.25 26.83,32.6 26.03,31.8 26.03,31.67 v2(25.91,31.55)
  Bottom Layer w0.152: v2(25.91,31.55) 23.37,29.01 23.37,22.53 21.84,21.01 17.27,21.01 16.76,20.5 16.76,19.1 9.91,12.24 8.64,12.24 8.62,12.26 7.07,12.26 6.04,11.23 U6.6
PA3: length 33.2
  Top Layer w0.152: U1.26 29.03,32.62 v2(29.97,31.67)
  Bottom Layer w0.152: U5.6 41.66,16.18 41.66,27.1 37.08,31.67 32,31.67 31.62,31.29 30.35,31.29 v2(29.97,31.67)
PA4: length 34.8
  Top Layer w0.152: 30.09,33.69 31.21,32.56 33.4,32.56 35.43,30.53 38.1,30.53 41.66,26.98 41.66,16.69 45.72,12.62 48.39,12.62 49.15,11.86 U5.5
PA8: length 17
  Top Layer w0.152: U5.40 37.3,54.41 31.86,48.96
PA15: length 26.7
  Top Layer w0.152: U1.77 26.48,51.42 27.18,50.72 27.56,50.72 27.81,50.98 27.81,51.99 26.8,53.01 v2(26.8,54.92)
  Bottom Layer w0.152: U5.42 28.83,56.95 v2(26.8,54.92)
PB1: length 24.7
  Top Layer w0.152: U1.36 34.29,34.43 34.29,33.58 36.32,31.55 38.99,31.55 43.18,27.36 43.18,22.28 U5.12
PB3: length 15.8
  Top Layer w0.152: 7.49,46.79 8.76,46.79 10.29,48.31 21.08,48.31 22.2,47.19 22.24,47.19
PB4: length 18.7
  Top Layer w0.152: 21.89,46.84 21.89,46.89 20.83,47.94 10.35,47.94 8.17,45.76 5.98,45.76 U6.34
PB5: length 18.5
  Top Layer w0.152: U6.32 5.98,45.28 8.18,45.28 10.54,47.64 20.38,47.64 U1.91
PB6: length 19.2
  Top Layer w0.152: v2(20.07,47.21) 20.09,47.21 U1.92
  Bottom Layer w0.152: 7.49,41.71 11.18,45.39 11.18,47.55 12.7,49.07 18.08,49.07 18.23,48.92 18.26,48.92 18.4,48.79 18.49,48.79 v2(20.07,47.21)
PB7: length 22.5
  Top Layer w0.152: 20.82,45.77 21.84,44.76 v2(21.84,44.12)
  Bottom Layer w0.152: v2(21.84,44.12) 21.21,43.49 21.21,40.95 20.7,40.44 6.22,40.44 U6.30
PB8: length 17.3
  Top Layer w0.152: U1.95 19.49,45.7 11.05,45.7 9.98,44.63 9.98,41.66 7.49,39.17
PB9: length 19.2
  Top Layer w0.152: 7.49,36.63 10.29,39.42 10.29,44.5 11.18,45.39 19.09,45.39 U1.96
PB10: length 18.1
  Top Layer w0.152: 36.45,40.05 36.46,40.05 37.46,39.04 37.46,38.28 39.88,35.87 41.66,35.87 43.05,34.47 43.05,33.45 45.99,30.52 47.03,30.52 48.06,31.55 U5.21
PB11: length 14
  Top Layer w0.152: 36.8,40.4 37.85,39.36 37.85,38.41 40,36.25 41.91,36.25 U5.22
PB12: length 13.3
  Top Layer w0.152: U5.26 46.23,36.63 45.59,37.26 45.59,38.15 39.37,44.37 38.58,44.37 U1.51
PB13: length 15.9
  Top Layer w0.152: U1.52 38.64,45.14 39.19,45.14 46.18,38.14 47.03,38.14 48.06,39.17 49.15,39.17
PB14: length 13.2
  Top Layer w0.152: 36.8,44.01 38.44,45.64 39.62,45.64 46.1,39.17 46.61,39.17
PB15: length 16.1
  Top Layer w0.152: U1.54 36.45,44.38 38.1,46.03 39.88,46.03 45.34,40.56 48.01,40.56 U5.29
PC0: length 23
  Top Layer w0.152: v2(22.27,35.15) 23.28,36.16 U1.15
  Bottom Layer w0.152: 7.49,21.39 9.27,23.17 9.27,24.94 13.59,29.26 16.38,29.26 v2(22.27,35.15)
PC1: length 27.5
  Top Layer w0.152: v2(22.69,34.72) 22.69,34.84 23.65,35.81
  Bottom Layer w0.152: v2(22.69,34.72) 22.69,34.3 17.14,28.75 13.97,28.75 9.91,24.69 9.91,22.15 7.87,20.12 6.22,20.12 U6.12
PC2: length 25.4
  Top Layer w0.152: v2(23.11,34.26) 23.11,34.6 23.97,35.45 U1.17
  Bottom Layer w0.152: v2(23.11,34.26) 23.11,33.71 17.65,28.25 14.35,28.25 10.54,24.44 10.54,21.9 7.49,18.85
PC3: length 29.8
  Top Layer w0.152: U1.18 23.58,34.32 v2(23.58,33.81)
  Bottom Layer w0.152: v2(23.58,33.81) 23.58,33.16 18.03,27.61 14.48,27.61 11.05,24.18 11.05,20.88 7.51,17.34 7.07,17.34 6.04,16.31 4.95,16.31
PC4: length 26.6
  Top Layer w0.152: U1.33 35.74,30.86 38.4,30.86 42.16,27.1 42.16,20.75 46.61,16.31
PC5: length 28.9
  Top Layer w0.152: 49.15,16.31 49.15,16.69 48.02,17.82 46.18,17.82 42.67,21.33 42.67,27.23 38.73,31.17 36.14,31.17 31.86,35.45
PC6: length 19.6
  Top Layer w0.152: U5.39 49.15,53.32 48.12,52.29 48.12,51.85 46.99,50.72 45.9,50.72 44.63,49.45 35.18,49.45 U1.63
PC7: length 15.3
  Top Layer w0.152: U1.64 34.85,49.84 44.58,49.84 U5.38
PC13: length 21
  Top Layer w0.152: U1.7 20.43,38.99 19.77,38.33 19.3,38.33 v2(19.18,38.45)
  Bottom Layer w0.152: 7.49,23.93 13.68,30.11 13.68,30.63 13.97,30.92 13.97,31.67 19.18,36.88 v2(19.18,38.45)
PD0: length 20.6
  Top Layer w0.152: v2(24,51.36) 24.38,50.97 24.38,50.72 25.07,50.04 25.07,50.02
  Bottom Layer w0.152: 7.49,56.95 12.32,56.95 16.13,53.14 22.22,53.14 v2(24,51.36)
PD1: length 22.8
  Top Layer w0.152: v2(23.61,50.72) 24.66,49.67 U1.82
  Bottom Layer w0.152: v2(23.61,50.72) 21.57,52.76 15.87,52.76 12.95,55.68 6.22,55.68 U6.42
PD3: length 18.8
  Top Layer w0.152: U1.84 23.99,48.96 22.61,50.34 11.68,50.34 7.62,54.41 7.49,54.41
PD4: length 21.1
  Top Layer w0.152: 23.65,48.61 22.35,49.91 11.56,49.91 8.09,53.38 7.07,53.38 6.04,54.41 U6.40
PD5: length 17.3
  Top Layer w0.152: 7.49,51.87 9.91,49.45 22.1,49.45 U1.86
PD6: length 19.6
  Top Layer w0.152: U1.87 22.89,47.9 21.72,49.07 17.76,49.07 17.75,49.08 17.56,49.08 17.55,49.07 9.52,49.07 8.13,50.47 6.35,50.47 U6.38
PD7: length 15.8
  Top Layer w0.152: U1.88 22.59,47.56 21.46,48.69 8.13,48.69 7.49,49.33
PD8: length 13.2
  Top Layer w0.152: U5.30 41.91,46.41 37.79,46.41 U1.55
PD9: length 16.2
  Top Layer w0.152: U1.56 35.75,45.07 37.46,46.79 42.55,46.79 46.36,42.98 47.88,42.98 U5.31
PD10: length 13.2
  Top Layer w0.152: U1.57 37.14,47.17 43.69,47.17 U5.32
PD11: length 16
  Top Layer w0.152: U5.33 48.06,46.79 47.03,45.76 46.18,45.76 45.15,46.79 45.15,46.79 45.13,46.81 45.12,46.81 44.38,47.55 36.81,47.55 U1.58
PD12: length 13.2
  Top Layer w0.152: U1.59 34.68,46.16 36.45,47.93 45.47,47.93 U5.34
PD13: length 16
  Top Layer w0.152: U5.35 48.12,48.3 36.18,48.3 34.37,46.48 U1.60
PD14: length 13.7
  Top Layer w0.152: 33.98,46.84 35.83,48.69 45.97,48.69 U5.36
PD15: length 17.5
  Top Layer w0.152: U5.37 47.64,50.36 45.96,50.36 44.68,49.07 35.51,49.07 33.62,47.19
PE0: length 22.9
  Top Layer w0.152: U6.26 6.1,35.48 8,35.48 10.59,38.08 10.59,44.37 11.3,45.09 18.69,45.09 U1.97
PE1: length 20.3
  Top Layer w0.152: U1.98 19.06,44.01 18.29,44.78 11.43,44.78 10.92,44.27 10.92,37.52 7.49,34.09
PE2: length 16.6
  Top Layer w0.152: U1.1 18.33,41.11 17.02,39.8 12.75,39.8 11.23,38.28 11.23,37.39 9.14,35.31 9.14,33.2 7.49,31.55
PE3: length 20.9
  Top Layer w0.152: 18.7,40.76 18.7,40.73 17.14,39.17 12.95,39.17 11.81,38.02 11.81,37.01 9.78,34.98 9.78,32.18 7.63,30.04 7.07,30.04 6.04,29.01 U6.20
PE4: length 18.6
  Top Layer w0.152: U1.3 19.06,40.32 17.4,38.66 13.33,38.66 12.45,37.77 12.45,36.88 10.29,34.72 10.29,34.1 10.27,34.08 10.27,33.55 10.29,33.54 10.29,31.8 7.49,29.01
PE5: length 20.5
  Top Layer w0.152: 19.41,40.05 19.39,40.05 v2(18.59,39.25)
  Bottom Layer w0.152: v2(18.59,39.25) 18.54,39.29 17.65,39.29 16.96,38.6 14.8,38.6 13.97,37.77 13.97,33.83 7.37,27.23 7.37,26.59 7.49,26.47
PE6: length 23.1
  Top Layer w0.152: v2(18.03,38.53) 18.59,38.53 U1.5
  Bottom Layer w0.152: 18.03,38.53 18.03,37.01 9.27,28.25 9.27,26.72 7.51,24.96 7.07,24.96 6.04,23.93 U6.16
PE7: length 28
  Top Layer w0.152: U1.38 34.1,36.04 v2(34.16,36.04)
  Bottom Layer w0.152: v2(34.16,36.04) 37.29,36.04 43.18,30.15 43.18,24.05 44.45,22.78 47.12,22.78 47.88,22.02 47.88,20.12 U5.11
PE8: length 21.4
  Top Layer w0.152: 46.61,21.39 46.61,21.64 43.56,24.69 43.56,27.56 35.76,35.36 35.49,35.36 33.62,37.22
PE9: length 23.8
  Top Layer w0.152: U1.40 43.94,27.61 43.94,25.07 46.23,22.78 48.51,22.78 49.15,22.15 49.15,21.39
PE10: length 19.2
  Top Layer w0.152: U1.41 44.45,27.81 44.45,25.83 46.36,23.93 U5.16
PE11: length 21.8
  Top Layer w0.152: U1.42 44.83,28.13 44.83,26.09 45.59,25.32 48.13,25.32 49.15,24.31 U5.15
PE12: length 17
  Top Layer w0.152: U5.18 46.61,26.59 45.34,27.86 45.34,28.33 40.14,33.53 40.13,33.53 36.02,37.64 36.02,37.66 35.04,38.64
PE13: length 19.4
  Top Layer w0.152: U1.44 36.4,37.98 36.4,37.76 46.3,27.86 48.26,27.86 49.15,26.98 U5.17
PE14: length 16.2
  Top Layer w0.152: U5.20 46.08,29.01 42.29,32.8 42.29,34.21 41.27,35.23 39.5,35.23 36.7,38.02 36.7,38.38 U1.45
PE15: length 18.4
  Top Layer w0.152: U1.46 37.08,38.71 37.08,38.23 39.75,35.56 41.45,35.56 42.67,34.34 42.67,33.2 45.72,30.15 48.01,30.15 U5.19
RESET: length 21.9
  Top Layer w0.152: SW1.1 27.3,26.35 R3.2 26.67,26.98 26.67,27.99 26.42,28.25 ; 26.42,28.25 30.1,28.25 30.42,27.93 C5.1 ; 26.42,28.25 26.29,28.37 25.27,28.37 24.51,29.13 24.51,32.06 21.72,34.85 21.72,35.24 22.95,36.47 U1.14
SDIO_CMD: length 19.4
  Top Layer w0.152: v2(24.77,61.01) 23.37,61.01 22.73,60.38 R7.2 23.7,57.62 23.7,52.37 23.72,52.35 23.72,52.26 23.11,51.65 23.11,50.6 24.36,49.35 U1.83 ; v2(27.56,62.66) 27.56,63.99 27.51,64.04
  Bottom Layer w0.152: v2(24.77,61.01) 25.91,61.01 v2(27.56,62.66)
SDIO_D0: length 17.7
  Top Layer w0.152: U1.65 32.58,48.25 v2(34.42,50.09) ; 31.91,64.04 31.91,59.87 32.26,59.52 R8.2 33.53,57.07 33.53,52.82 v2(33.59,52.76)
  Bottom Layer w0.152: v2(34.42,50.09) 34.54,50.22 34.54,51.8 v2(33.59,52.76)
SDIO_D1: length 20.2
  Top Layer w0.152: v2(34.35,54.15) 34.35,57.01 34.42,57.07 34.43,57.07 R9.2 35.69,59.74 35.31,60.12 33.4,60.12 33.01,60.51 33.01,64.04 ; v2(35.69,52.12) 32.21,48.64 32.21,48.61
  Bottom Layer w0.152: v2(35.69,52.12) 35.69,52.82 v2(34.35,54.15)
SDIO_D2: length 15
  Top Layer w0.152: U1.78 25.27,51.93 25.27,52.76 26.03,53.52 26.03,57.32 R5.2 27.3,60.12 25.31,62.12 CARD1.1
SDIO_D3: length 20.7
  Top Layer w0.152: 26.41,64.04 26.41,65.21 25.91,65.71 24.13,65.71 23.75,65.33 23.75,63.04 25.27,61.52 25.27,58.84 R6.2 25.02,58.47 24,57.46 24,52.5 U1.79
SDIO_SCK: length 20.5
  Top Layer w0.152: v2(26.29,49.45) 25.42,50.32 U1.80 ; v2(30.52,52.88) 30.99,52.88 31.24,53.14 31.24,53.9 31.88,54.53 31.88,54.92 31.5,55.3 30.35,55.3 29.72,55.93 29.72,64.03 CARD1.5
  Bottom Layer w0.152: v2(26.29,49.45) 27.1,49.45 v2(30.52,52.88)
SPI1_MISO: length 14.9
  Top Layer w0.152: v2(34.92,40.95) 29.84,35.87 29.84,35.36 30.79,34.41 U1.31
  Bottom Layer w0.152: v2(34.92,40.95) 34.92,42.72 33.4,44.25 U4.2
SPI1_MOSI: length 15.9
  Top Layer w0.152: U1.32 31.09,34.75 30.35,35.48 v2(30.35,35.74)
  Bottom Layer w0.152: U4.5 22.86,41.71 22.61,41.45 22.61,40.82 23.11,40.31 28.32,40.31 31.17,37.47 31.17,36.63 30.35,35.82 v2(30.35,35.74)
SPI1_SCK: length 18.7
  Top Layer w0.152: v2(29.46,34.85) 29.59,34.72 29.72,34.72 30.4,34.04 U1.30
  Bottom Layer w0.152: v2(29.46,34.85) 29.46,35.48 30.86,36.88 30.86,37.26 28.19,39.93 22.86,39.93 22.1,40.69 22.1,42.34 22.73,42.98 U4.6
SW_CLK: length 37.1
  Top Layer w0.152: U1.76 26.16,52.46 v2(26.16,52.76) ; P2.3 9.4,71.7 9.4,65.46 12.32,62.54 v1(12.32,62.41)
  Bottom Layer w0.152: v2(26.16,52.76) 25.42,53.49 17.37,53.49 17.37,53.5 16.36,53.5 14.46,55.4 14.46,61.25 13.3,62.41 v1(12.32,62.41)
SW_DIO: length 43
  Top Layer w0.152: v2(31.75,53.52) 31.75,52.39 30.09,50.73 ; P2.2 11.3,72.29 11.3,65.96 14.1,63.17 v1(14.22,63.17)
  Bottom Layer w0.152: v2(31.75,53.52) 30.95,53.52 30.67,53.8 16.49,53.8 14.76,55.53 14.76,61.37 13.97,62.17 13.97,62.92 v1(14.22,63.17)
USART1_RX: length 30.6
  Top Layer w0.152: P1.2 45.74,64.26 U1.69
USART1_TX: length 31.9
  Top Layer w0.152: P1.3 48.24,72.68 46.23,70.66 46.23,63.99 31.67,49.44 31.63,49.44 U1.68
USB_DM: length 47.6
  Top Layer w0.152: v2(23.24,13) 23.24,12.24 22.35,11.35 R2.1 ; U1.70 30.79,50.02 29.97,49.2 29.97,48.69 v2(30.35,48.31)
  Bottom Layer w0.152: v2(30.35,48.31) 30.35,47.42 28.45,45.52 28.45,42.47 31.88,39.04 31.88,35.87 28.97,32.96 28.72,32.96 27.3,31.55 27.3,19.86 23.24,15.8 v2(23.24,13)
USB_DP: length 49.2
  Top Layer w0.152: v2(29.34,49.33) 29.39,49.33 U1.71 ; v2(19.68,12.88) 19.68,12.24 20.57,11.35 R1.1
  Bottom Layer w0.152: v2(29.34,49.33) 29.34,48.82 29.59,48.57 29.59,47.3 28.07,45.77 28.07,42.22 31.5,38.79 31.5,36.12 28.64,33.26 28.42,33.26 26.92,31.76 26.92,20.12 v2(19.68,12.88)
VREF+: length 35.6
  Top Layer w0.152: v2(24.49,32.67) 24.77,32.94 24.77,33.33 25.42,33.98 U1.21 25.48,34.04 26.29,34.85 26.42,34.85 v2(26.67,34.6)
  Bottom Layer w0.152: v2(26.67,34.6) 27.6,34.6 28.23,35.22 ; 24.38,32.56 18.42,26.59 14.99,26.59 14.86,26.47 14.86,21.13 13.72,19.99 12.7,19.99 7.51,14.8 7.07,14.8 6.04,13.77 U6.8
VREF-: length 31.2
  Top Layer w0.152: v2(24.18,33.37) 24.18,33.5 25.65,34.98 25.65,35.87 v2(25.27,36.25)
  Bottom Layer w0.152: R13.1 26.07,37.04 v2(25.27,36.25) ; 7.49,16.31 11.56,20.37 11.56,24.05 14.61,27.1 18.29,27.1 24.18,32.99 v2(24.18,33.37)
WK_UP: length 24.8
  Top Layer w0.152: R10.1 34.43,28.11 33.78,28.75 ; U1.23 27.01,34.21 27.56,34.21 27.94,33.83 27.94,31.55 28.7,30.79 28.7,29.13 29.08,28.75 33.78,28.75 ; 33.78,28.75 37.72,28.75 38.1,28.37 38.1,27.04 C9.1 39.08,26.06 SW2.2
$1N889: length 3
  Top Layer w0.152: U2.2 21.19,5.91 20.57,6.53 R1.2
$1N893: length 3
  Top Layer w0.152: U2.3 21.84,5.89 22.35,6.4 R2.2
$1N2632: length 4.9
  Top Layer w0.152: LED1.2 31.48,9.45 29.97,9.45 28.46,7.93 R4.1
$1N4325: length 7.6
  Bottom Layer w0.152: D1.2 21.62,46.12 22.22,45.52 22.22,45.14 22.16,45.07 18.39,45.07 BT1.2
$1N5861: length 3.7
  Top Layer w0.152: U1.37 33.82,35.61 34.16,35.61 35.43,34.35 35.72,34.35
$1N7095: length 18.3
  Top Layer w0.152: X1.2 22.67,24.08 C11.2 22.54,26.98 20.06,26.98 20.06,33.5 21.21,34.65 21.21,35.45 22.13,36.37 22.13,36.42 22.26,36.55 22.26,36.59 22.41,36.74 22.46,36.74 U1.13
$1N7100: length 19.4
  Top Layer w0.152: X1.1 16.47,22.91 16.22,23.17 16.22,23.58 15.49,24.31 15.49,27.1 R16.2 18.42,32.7 20.57,34.85 20.57,35.6 22.07,37.09 22.11,37.09 U1.12
$1N7274: length 9.8
  Top Layer w0.152: 20.82,38.64 20.21,38.02 16.76,38.02 14.62,35.88 14.46,35.88 14.46,35.75 X2.2
$1N7293: length 11.4
  Top Layer w0.152: C13.2 15.62,34.85 15.62,36.32 16.89,37.59 20.53,37.59 21.18,38.24 U1.9 ; X2.1 14.87,32.55 16.27,33.95 16.52,33.95
$1N7439: length 12.7
  Top Layer w0.152: U1.73 30.06,51.41 30.06,51.45 30.86,52.24 30.86,52.29 v2(30.94,52.38)
  Bottom Layer w0.152: C15.2 38.16,54.22 37.34,55.04 33.05,55.04 32.39,54.38 32.39,53.01 31.88,52.5 31.07,52.5 v2(30.94,52.38)
$1N7444: length 2.6
  Top Layer w0.152: C14.2 39,38.91 U1.49

## Copper pours and planes (outline as drawn; the poured copper is in the pictures)
3.3V on 3.3V: 0,80.06 54.53,80.06 54.53,0 0,0
GND on Top Layer: 0,80.06 54.53,80.06 54.53,0 0,0
GND on Bottom Layer: 0,80.06 54.53,80.06 54.53,0 0,0
GND on GND: 0,80.06 54.53,80.06 54.53,0 0,0

Small or netless copper shapes (teardrops, artwork), in the pictures only: 300 on Top Layer, 89 on Bottom Layer, 90 on GND, 44 on 3.3V

## Text on the board
Top Silkscreen Layer: GND | CLK | DIO | 3.3V | RX | TX | VREF+ | PE3 | PE6 | PC3 | PA2 | PD1 | PD4 | PD6 | PB4 | PB5 | PB7 | PE0 | PC1 | PD0 | PD3 | PD5 | PD7 | PB3 | BOOT0 | PB6 | PB8 | PB9 | PE1 | PE2 | PE4 | PE5 | PC13 | PC0 | PC2 | VREF- | PA1 | PA15 | PD14 | PD12 | PD10 | PB14 | PB12 | PE14 | PE12 | PE10 | PB11 | PA8 | PC7 | PD8 | PE8 | PC4 | PA3 | PB1 | PC6 | PD15 | PD13 | PD11 | PD9 | PB15 | PB13 | PB10 | PE15 | PE13 | PE11 | PE9 | PE7 | PC5 | PA4
